# Altium schematic sheet Power & SD.SchDoc
size A3
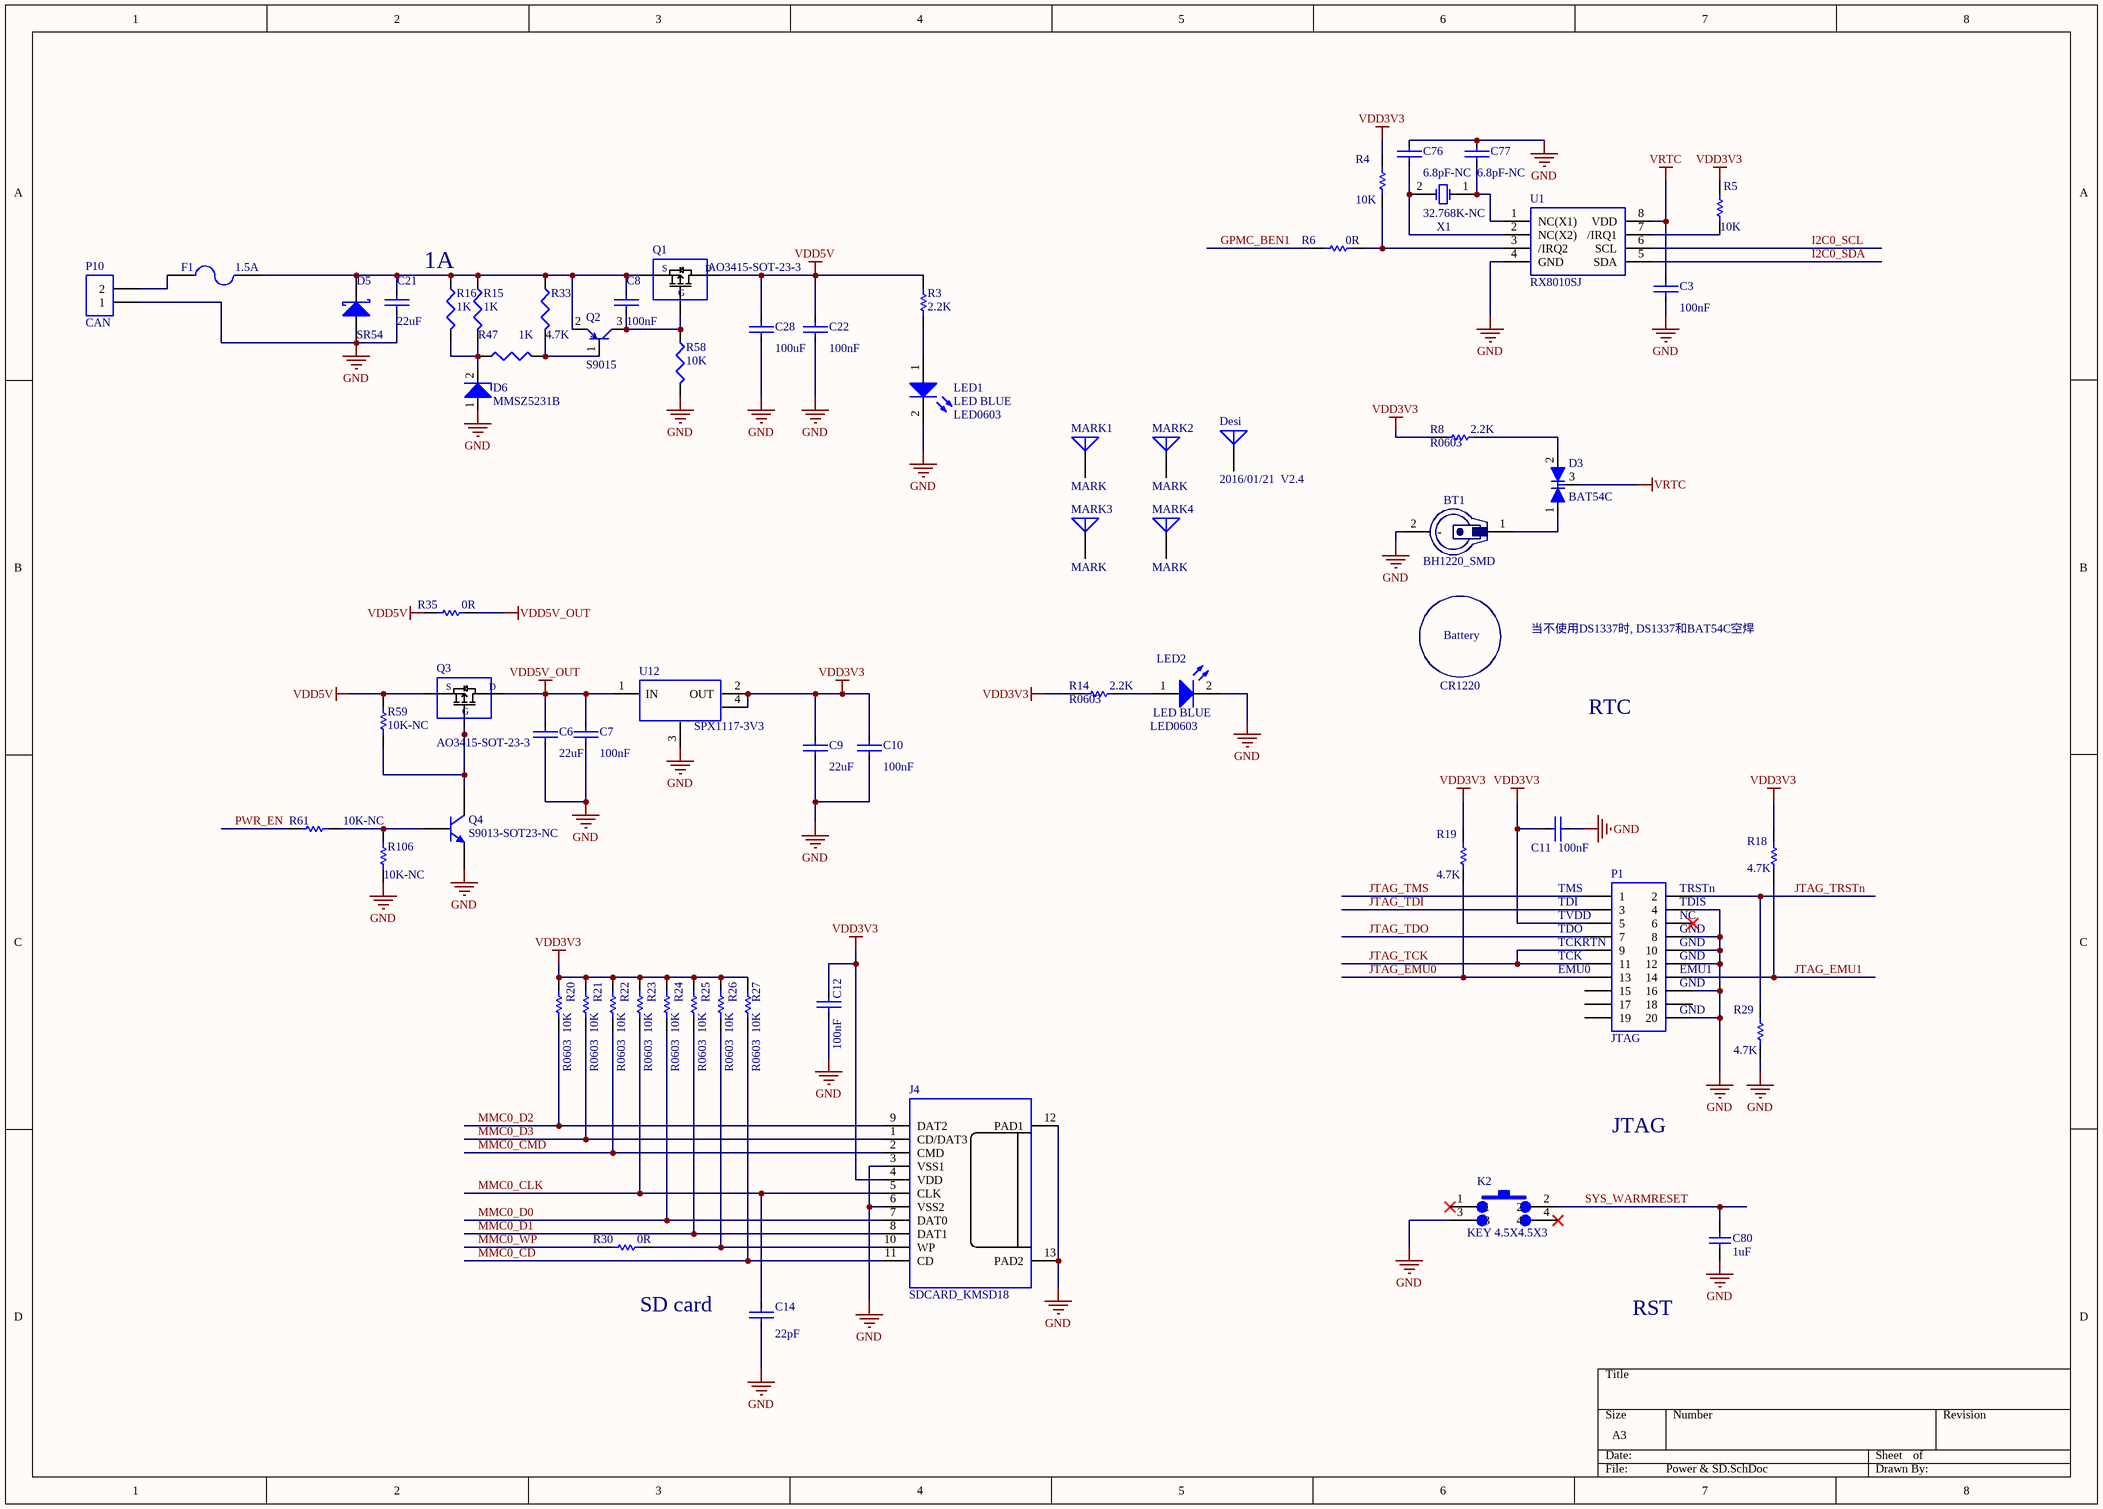
[diagram p0: Power & SD.SchDoc]

## Parts
BT1  BH1220_SMD  [BH-1220 Battery]
C3  100nF  [C0603_M1608]
C6  22uF  [C1210_M3225]
C7  100nF  [C0603_M1608]
C8  100nF  [C0603_M1608]
C9  22uF  [C1210_M3225]
C10  100nF  [C0603_M1608]
C11  100nF  [C0603_M1608]
C12  100nF  [C0603_M1608]
C14  22pF  [C0603_M1608]
C21  22uF  [C1210_M3225]
C22  100nF  [C0603_M1608]
C28  100uF  [C1210_M3225]
C76  6.8pF-NC  [C0603_M1608]
C77  6.8pF-NC  [C0603_M1608]
C80  value 1uF  [C0603_M1608]  (hidden comment: C0603)
D3  BAT54C  [SOT23-3D-C95P280X100]
D5  SR54  [SMB/DO-214AA]
D6  MMSZ5231B  [SOD123]
Desi  2016/01/21  V2.4  [LOGO]
F1  value 1.5A  [R_1210]  (hidden comment: Fuse 2)
J4  SDCARD_KMSD18  [SDcard_KDMS18]
K2  KEY 4.5X4.5X3  [SWPB-4]
LED1  LED BLUE  value LED0603  [LED0603_M1608]
LED2  LED BLUE  value LED0603  [LED0603_M1608]
MARK1  MARK  [MARK]
MARK2  MARK  [MARK]
MARK3  MARK  [MARK]
MARK4  MARK  [MARK]
P1  JTAG  [IDC20S]
P10  CAN  [2EDGKA-5.08-2P]
Q1  AO3415-SOT-23-3  [SOT23]
Q2  S9015  [SOT23]
Q3  AO3415-SOT-23-3  [SOT23]
Q4  S9013-SOT23-NC  [SOT23]
R3  2.2K  [R0603_M1608]
R4  10K  [R0603_M1608]
R5  10K  [R0603_M1608]
R6  0R  [R0603_M1608]
R8  2.2K  value R0603  [R0603_M1608]
R14  2.2K  value R0603  [R0603_M1608]
R15  value 1K  [0603]  (hidden comment: Res3)
R16  value 1K  [0603]  (hidden comment: Res3)
R18  4.7K  [R0603_M1608]
R19  4.7K  [R0603_M1608]
R20  10K  value R0603  [R0603_M1608]
R21  10K  value R0603  [R0603_M1608]
R22  10K  value R0603  [R0603_M1608]
R23  10K  value R0603  [R0603_M1608]
R24  10K  value R0603  [R0603_M1608]
R25  10K  value R0603  [R0603_M1608]
R26  10K  value R0603  [R0603_M1608]
R27  10K  value R0603  [R0603_M1608]
R29  4.7K  [R0603_M1608]
R30  0R  [R0603_M1608]
R33  value 4.7K  [0603]  (hidden comment: Res3)
R35  0R  [R0603_M1608]
R47  value 1K  [0603]  (hidden comment: Res3)
R58  value 10K  [0603]  (hidden comment: Res3)
R59  10K-NC  [R0603_M1608]
R61  10K-NC  [R0603_M1608]
R106  10K-NC  [R0603_M1608]
U1  RX8010SJ  [SOP-8 - RX8010SJ]
U12  value SPX1117-3V3  [LM1117]  (hidden comment: LM1117)
X1  32.768K-NC  [CRYSTALS_3215_2PIN]

## Nets
GND: BT1.2(-) C3.2 C6.2 C7.2 C9.2 C10.2 C11.2 C12.2 C14.2 C21.2 C22.2 C28.2 C76.1 C77.1 C80.1 D5.1(A) D6.1(A) J4.3(VSS1) J4.6(VSS2) J4.12(PAD1) J4.13(PAD2) K2.3 LED1.2(K) LED2.2(K) P1.4 P1.8 P1.10 P1.12 P1.16 P1.20 P10.1 Q4.2(E) R29.2 R58.2 R106.2 U1.4(GND) U12.3(GND)
VDD3V3: C9.1 C10.1 C11.1 C12.1 J4.4(VDD) P1.5 R4.1 R5.1 R8.2 R14.2 R18.1 R19.1 R20.1 R21.1 R22.1 R23.1 R24.1 R25.1 R26.1 R27.1 U12.2(OUT) U12.4
VDD5V: C22.1 C28.1 Q1.3(D) Q3.2(S) R3.2 R35.2 R59.2
VDD5V_OUT: C6.1 C7.1 Q3.3(D) R35.1 U12.1(IN)
VRTC: C3.1 D3.3 U1.8(VDD)
GPMC_BEN1: R6.2
I2C0_SCL: U1.6(SCL)
I2C0_SDA: U1.5(SDA)
JTAG_EMU0: P1.13 R19.2
JTAG_EMU1: P1.14 R18.2
JTAG_TCK: P1.9 P1.11
JTAG_TDI: P1.3
JTAG_TDO: P1.7
JTAG_TMS: P1.1
JTAG_TRSTn: P1.2 R29.1
MMC0_CD: J4.11(CD) R27.2
MMC0_CLK: C14.1 J4.5(CLK) R23.2
MMC0_CMD: J4.2(CMD) R22.2
MMC0_D0: J4.7(DAT0) R24.2
MMC0_D1: J4.8(DAT1) R25.2
MMC0_D2: J4.9(DAT2) R20.2
MMC0_D3: J4.1(CD/DAT3) R21.2
MMC0_WP: R30.2
PWR_EN: R61.2
SYS_WARMRESET: C80.2 K2.2
NetBT1_1: BT1.1(+) D3.1
NetC8_1: C8.1 C21.1 D5.2(K) F1.2 Q1.2(S) Q2.2(E) R15.1 R16.1 R33.1
NetC8_2: C8.2 Q1.1(G) Q2.3(C) R58.1
NetC76_2: C76.2 U1.2(NC(X2)) X1.2(OSC2)
NetC77_2: C77.2 U1.1(NC(X1)) X1.1(OSC1)
NetD3_2: D3.2 R8.1
NetD6_2: D6.2(K) R15.2 R16.2 R47.1
NetF1_1: F1.1 P10.2
NetJ4_10: J4.10(WP) R26.2 R30.1
NetLED1_1: LED1.1(A) R3.1
NetLED2_1: LED2.1(A) R14.1
NetQ2_1: Q2.1(B) R33.2 R47.2
NetQ3_1: Q3.1(G) Q4.3(C) R59.1
NetQ4_1: Q4.1(B) R61.1 R106.1
NetR4_2: R4.2 R6.1 U1.3(/IRQ2)
NetR5_2: R5.2 U1.7(/IRQ1)

Not connected (* = marked no-connect by the designer): Desi 1(A); K2 1* 4*; MARK1 1(A); MARK2 1(A); MARK3 1(A); MARK4 1(A); P1 6* 15 17 18 19

## Notes on the sheet
- 1A
- Battery
- 当不使用DS1337时, DS1337和BAT54C空焊
- CR1220
- RTC
- TMS
- (near P1) TDI
- (near P1) TVDD
- (near P1) TRSTn
- (near P1) TDIS
- (near P1) NC
- (near P1) TDO
- (near P1) TCKRTN
- (near P1) TCK
- (near P1) EMU0
- (near P1) GND
- (near P1) EMU1
- JTAG
- SD card
- RST

## Library data of the parts
BT1 = Battery
C3 C6-C12 C14 C21 C22 C28 C76 C77 = CAP_1: value: C0805
C80 = Cap: Capacitor; Published: 8-Jun-2000; LatestRevisionDate: 17-Jul-2002; LatestRevisionNote: Re-released for DXP Platform.; PackageReference: RAD-0.3; Publisher: Altium Limited
D3 = BAT54C: SOT23-3_D
D5 = Diode 11DQ03: Schottky Rectifier; Published: 8-Jun-2000; LatestRevisionDate: 17-Jul-2002; LatestRevisionNote: Re-released for DXP Platform.; DatasheetVersion: Dec-1997; PackageReference: DO-204AL; Publisher: Altium Limited; PackageDescription: Diode, Axial; Body 5.2 x 2.7 mm (LxDia. max), Lead Dia. 0.86 mm (max); Code_JEDEC: DO-204-AL; ComponentLink1Description: Manufacturer Link; ComponentLink1URL: http://www.irf.com/; ComponentLink2Description: Datasheet; ComponentLink2URL: http://www.irf.com/product-info/datasheets/data/11dq03.pdf
D6 = DIODE_ZENER
Desi MARK1-MARK4 = Antenna: Generic Antenna; Published: 24-Mar-1999; LatestRevisionDate: 17-Jul-2002; LatestRevisionNote: Re-released for DXP Platform.; PackageReference: PIN1; Publisher: Altium Limited
F1 = Fuse 2: Fuse; Published: 8-Jun-2000; LatestRevisionDate: 17-Jul-2002; LatestRevisionNote: Re-released for DXP Platform.; PackageReference: PIN-W2/E2.8; Publisher: Altium Limited; PackageDescription: Thru-Hole; 2 Leads
LED1 LED2 = LED2: Typical RED, GREEN, YELLOW, AMBER GaAs LED; Published: 8-Jun-2000; LatestRevisionDate: 17-Jul-2002; LatestRevisionNote: Re-released for DXP Platform.; PackageVersion: Feb-2002; PackageReference: 3.2X1.6X1.1; Publisher: Altium Limited; PackageDescription: SM LED; 2 Flat Leads
P1 = Header 10X2: Header, 10-Pin, Dual row; LatestRevisionDate: 17-Jul-2002; LatestRevisionNote: Re-released for DXP Platform.; Publisher: Altium Limited
P10 = Header 2: Header, 2-Pin; LatestRevisionDate: 17-Jul-2002; LatestRevisionNote: Re-released for DXP Platform.; Publisher: Altium Limited
Q1 Q3 = AO3415
Q2 = PNP_S
Q4 = S9013
R3-R6 R8 R14 R18-R27 R29 R30 R35 R59 R61 R106 = Res1: R0603; Published: 8-Jun-2000; LatestRevisionDate: 17-Jul-2002; LatestRevisionNote: Re-released for DXP Platform.; PackageReference: AXIAL-0.3; Publisher: Altium Limited; PackageDescription: Axial Device, Thru-Hole; 2 Leads; 0.3 in Pin Spacing
  R3-R6 R18 R19 R29 R30 R35 R59 R61 R106: Value: R0603
R15 R16 R33 R47 R58 = Res3: Resistor; Published: 8-Jun-2000; LatestRevisionDate: 29-May-2009; LatestRevisionNote: IPC-7351 Footprint Added.; PackageReference: J1-0603; Publisher: Altium Limited; PackageDescription: Chip Resistor
X1 = XTAL: Crystal Oscillator; Published: 8-Jun-2000; LatestRevisionDate: 17-Jul-2002; LatestRevisionNote: Re-released for DXP Platform.; PackageReference: R38; Publisher: Altium Limited